# EAGLE design fb-usb (EAGLE 4.16)
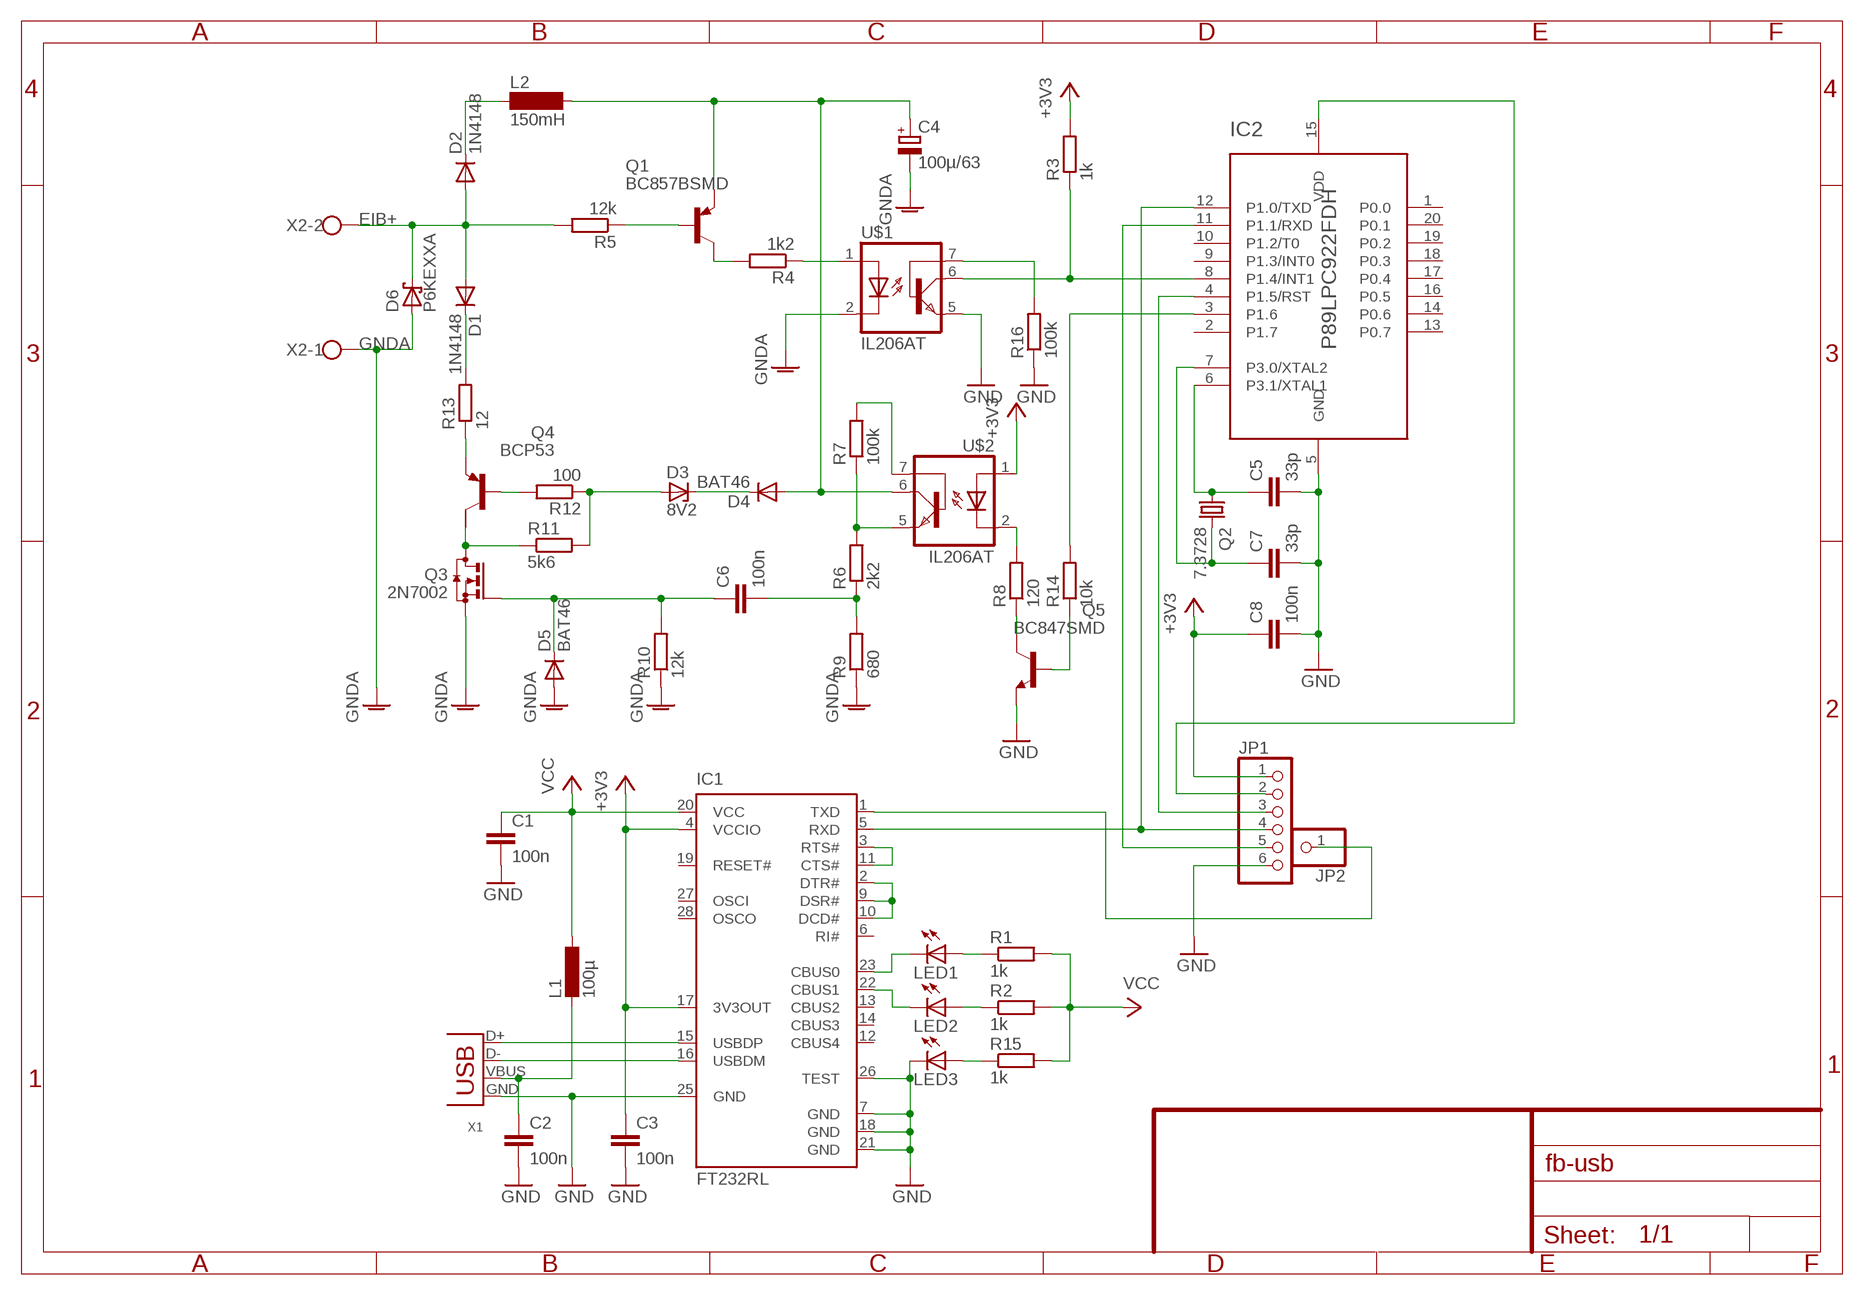
[diagram p0: schematic, sheet 1]

## Parts
C1  100n  C-EUC0805  [C0805]
C2  100n  C-EUC0805  [C0805]
C3  100n  C-EUC0805  [C0805]
C4  100µ/63  CPOL-EUE5-10.5  [E5-10,5]
C5  33p  C-EUC0805  [C0805]
C6  100n  C-EUC0805  [C0805]
C7  33p  C-EUC0805  [C0805]
C8  100n  C-EUC0805  [C0805]
D1  1N4148  DIODE-MINIMELF  [MINIMELF]
D2  1N4148  DIODE-MINIMELF  [MINIMELF]
D3  8V2  ZENER-DIODESOD80C  [SOD80C]
D4  BAT46  DIODE-MINIMELF  [MINIMELF]
D5  BAT46  DIODE-MINIMELF  [MINIMELF]
D6  P6KEXXA  [C1702-15]
IC1  FT232RL  [SSOP28]
IC2  P89LPC922FDH  [TSSOP20]
JP1  PINHD-1X6  [1X06]
JP2  PINHD-1X1  [1X01]
L1  100µ  L-EUL1812  [L1812]
L2  150mH  SD12-1000  [SD12_1000]
LED1  LED3MM  [LED3MM]
LED2  LED3MM  [LED3MM]
LED3  LED3MM  [LED3MM]
Q1  BC857BSMD  [SOT23-BEC]
Q2  7.3728  CRYSTALHC49U-V  [HC49U-V]
Q3  2N7002  BSS123  [SOT23]
Q4  BCP53  FZT753SMD  [SOT223]
Q5  BC847SMD  [SOT23]
R1  1k  R-EU_R1206  [R1206]
R2  1k  R-EU_M1206  [M1206]
R3  1k  R-EU_M0805  [M0805]
R4  1k2  R-EU_M1206  [M1206]
R5  12k  R-EU_M0805  [M0805]
R6  2k2  R-EU_M1206  [M1206]
R7  100k  R-EU_M0805  [M0805]
R8  120  R-EU_0207/10  [0207/10]
R9  680  R-EU_R1206  [R1206]
R10  12k  R-EU_M0805  [M0805]
R11  5k6  R-EU_M0805  [M0805]
R12  100  R-EU_M0805  [M0805]
R13  12  R-EU_0207/10  [0207/10]
R14  10k  R-EU_M0805  [M0805]
R15  1k  R-EU_M1206  [M1206]
R16  100k  R-EU_M0805  [M0805]
U$1  IL206AT  [SOIC08]
U$2  IL206AT  [SOIC08]
X1  USB-B-H  [USB-B-H]
X2  W237-02P  [W237-132]

## Nets
+3V3: C3.1 C8.1 IC1.4(VCCIO) IC1.17(3V3OUT) JP1.1 R3.2 U$2.1(A)
EIB+: D1.A D2.A D6.C R5.2 X2.2
GND: C1.2 C2.2 C3.2 C5.2 C7.2 C8.2 IC1.7(GND) IC1.18(GND) IC1.21(GND) IC1.25(GND) IC1.26(TEST) IC2.5(GND) JP1.6 LED3.K(C) Q5.2(E) R16.1 U$1.5(EMI) X1.GND
GNDA: C4.- D5.A D6.A Q3.2(S) R9.1 R10.1 U$1.2(C) X2.1
N$1: IC1.15(USBDP) X1.D+
N$2: IC1.16(USBDM) X1.D-
N$3: C2.1 L1.2 X1.VBUS
N$4: IC2.11(P1.1/RXD) JP1.5
N$5: IC1.23(CBUS0) LED1.K(C)
N$6: IC1.5(RXD) IC2.12(P1.0/TXD) JP1.4
N$7: IC1.22(CBUS1) LED2.K(C)
N$8: LED1.A R1.1
N$9: LED2.A R2.1
N$10: IC2.8(P1.4/INT1) R3.1 U$1.6(COL)
N$11: IC1.2(DTR#) IC1.9(DSR#) IC1.10(DCD#)
N$12: Q1.C R4.2
N$13: Q1.B R5.1
N$14: D2.C L2.1
N$15: R4.1 U$1.1(A)
N$16: D1.C R13.2
N$17: C4.+ D4.A L2.2 Q1.E U$2.6(COL)
N$18: R8.2 U$2.2(C)
N$19: R16.2 U$1.7(BAS)
N$20: IC2.3(P1.6) R14.2
N$21: R6.2 R7.1 U$2.5(EMI)
N$22: Q3.3(D) Q4.2(C) R11.1
N$23: C6.1 D5.C Q3.1(G) R10.2
N$24: D3.C D4.C
N$25: D3.A R11.2 R12.1
N$26: Q4.3(E) R13.1
N$27: Q4.1(B) R12.2
N$28: Q5.3(C) R8.1
N$29: Q5.1(B) R14.1
N$30: R7.2 U$2.7(BAS)
N$31: IC1.3(RTS#) IC1.11(CTS#)
N$32: IC2.4(P1.5/RST) JP1.3
N$33: IC2.15(VDD) JP1.2
N$34: C5.1 IC2.6(P3.1/XTAL1) Q2.1
N$35: C7.1 IC2.7(P3.0/XTAL2) Q2.2
N$36: IC1.1(TXD) JP2.1
N$37: C6.2 R6.1 R9.2
N$39: LED3.A R15.1
VCC: C1.1 IC1.20(VCC) L1.1 R1.2 R2.2 R15.2
Unconnected: IC1.6(RI#) IC1.12(CBUS4) IC1.13(CBUS2) IC1.14(CBUS3) IC1.19(RESET#) IC1.27(OSCI) IC1.28(OSCO) IC2.1(P0.0) IC2.2(P1.7) IC2.9(P1.3/INT0) IC2.10(P1.2/T0) IC2.13(P0.7) IC2.14(P0.6) IC2.16(P0.5) IC2.17(P0.4) IC2.18(P0.3) IC2.19(P0.2) IC2.20(P0.1) Q4.4(C/)

## Library data of the parts
C1-C3 C5-C8 = rcl:C-EU: CAPACITOR, European symbol
C4 = rcl:CPOL-EU: POLARIZED CAPACITOR, European symbol
D1 D2 D4 D5 = diode:DIODE-: DIODE
D3 = diode:ZENER-DIODE: Z-Diode
D6 = diode:P6KEXXA: DIODE transient-voltage suppressor
IC1 = ftdichip:FT232R: Source: http://www.ftdichip.com/Documents/DataSheets/DS_FT232R_v104.pdf
IC2 = micro-philips:P89LPC922FDH
JP1 = pinhead:PINHD-1X6: PIN HEADER
JP2 = pinhead:PINHD-1X1: PIN HEADER
L1 = rcl:L-EU: INDUCTOR, European symbol
L2 = inductor-neosid:SD12: INDUCTOR nominal inductance
LED1-LED3 = led:LED: LED OSRAM: - CHIPLED LG R971, LG N971, LY N971, LG Q971, LY Q971, LO R971, LY R971 LH N974, LH R974 LS Q976, LO Q976, LY Q976 LO Q996 - Hyper CHIPLED LW Q18S LB Q993, LB Q99A, LB R99A - SideLED LS A670, LO A670, LY A670, LG A670, LP A670 LB A673, LV A673, LT A673, LW A673 LH A674 LY A675 LS A676, LA A676, LO A676, LY A676, LW A676 LS A679, LY A679, LG A679 - Hyper Micro SIDELED® LS Y876, LA Y876, LO Y876, LY Y876 LT Y87S - SmartLED LW L88C, LW L88S LB L89C, LB L89S, LG L890 LS L89K, LO L89K, LY L89K LS L896, LA L896, LO L896, LY L896 - TOPLED LS T670, LO T670, LY T670, LG T670, LP T670 LSG T670, LSP T670, LSY T670, LOP T670, LYG T670 LG T671, LOG T671, LSG T671 LB T673, LV T673, LT T673, LW T673 LH T674 LS T676, LA T676, LO T676, LY T676, LB T676, LH T676, LSB T676, LW T676 LB T67C, LV T67C, LT T67C, LS T67K, LO T67K, LY T67K, LW E67C LS E67B, LA E67B, LO E67B, LY E67B, LB E67C, LV E67C, LT E67C LW T67C LS T679, LY T679, LG T679 LS T770, LO T770, LY T770, LG T770, LP T770 LB T773, LV T773, LT T773, LW T773 LH T774 LS E675, LA E675, LY E675, LS T675 LS T776, LA T776, LO T776, LY T776, LB T776 LHGB T686 LT T68C, LB T68C - Hyper Mini TOPLED® LB M676 - Mini TOPLED Santana® LG M470 LS M47K, LO M47K, LY M47K Source: http://www.osram.convergy.de - LUMILED® LXK2-PW12-R00, LXK2-PW12-S00, LXK2-PW14-U00, LXK2-PW14-V00 LXK2-PM12-R00, LXK2-PM12-S00, LXK2-PM14-U00 LXK2-PE12-Q00, LXK2-PE12-R00, LXK2-PE12-S00, LXK2-PE14-T00, LXK2-PE14-U00 LXK2-PB12-K00, LXK2-PB12-L00, LXK2-PB12-M00, LXK2-PB14-N00, LXK2-PB14-P00, LXK2-PB14-Q00 LXK2-PR12-L00, LXK2-PR12-M00, LXK2-PR14-Q00, LXK2-PR14-R00 LXK2-PD12-Q00, LXK2-PD12-R00, LXK2-PD12-S00 LXK2-PH12-R00, LXK2-PH12-S00 LXK2-PL12-P00, LXK2-PL12-Q00, LXK2-PL12-R00 Source: www.luxeon.com
Q1 = transistor-pnp:BC857*: PNP Transistror
Q2 = crystal:CRYSTAL: CRYSTAL
Q3 = transistor-small-signal:BSS123: N-CHANNEL MOS FET
Q4 = transistor-pnp:FZT753SMD: PNP Transistor
Q5 = transistor-npn:BC847*: NPN Transistor
R1-R16 = rcl:R-EU_: RESISTOR, European symbol
U$1 U$2 = optocoupler:IL206AT
X1 = con-usb-3:USB: USB Connectors
X2 = con-wago-508:W237-02P: WAGO SREW CLAMP

## Board
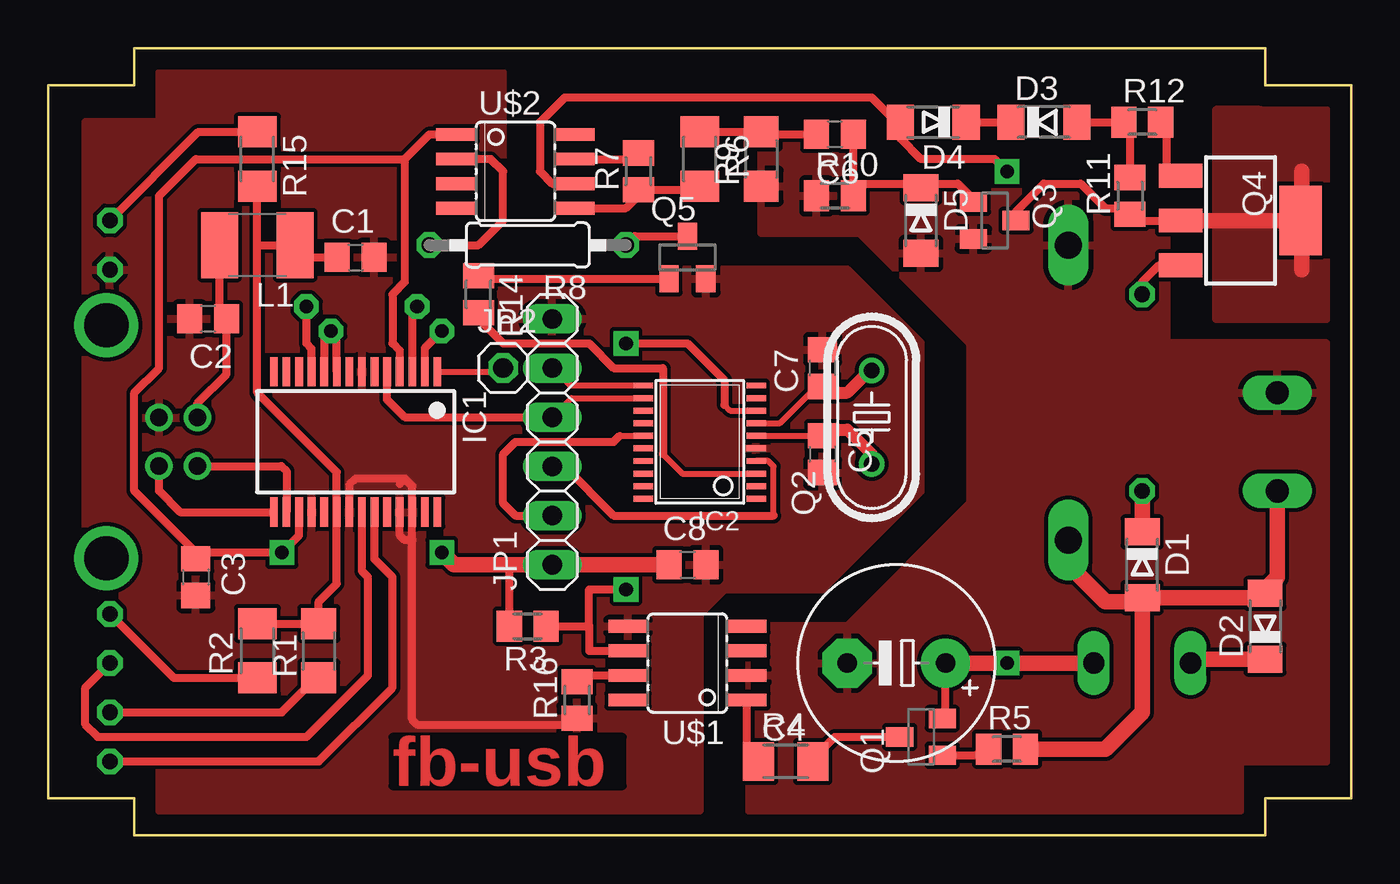
[diagram p1: board, top side]
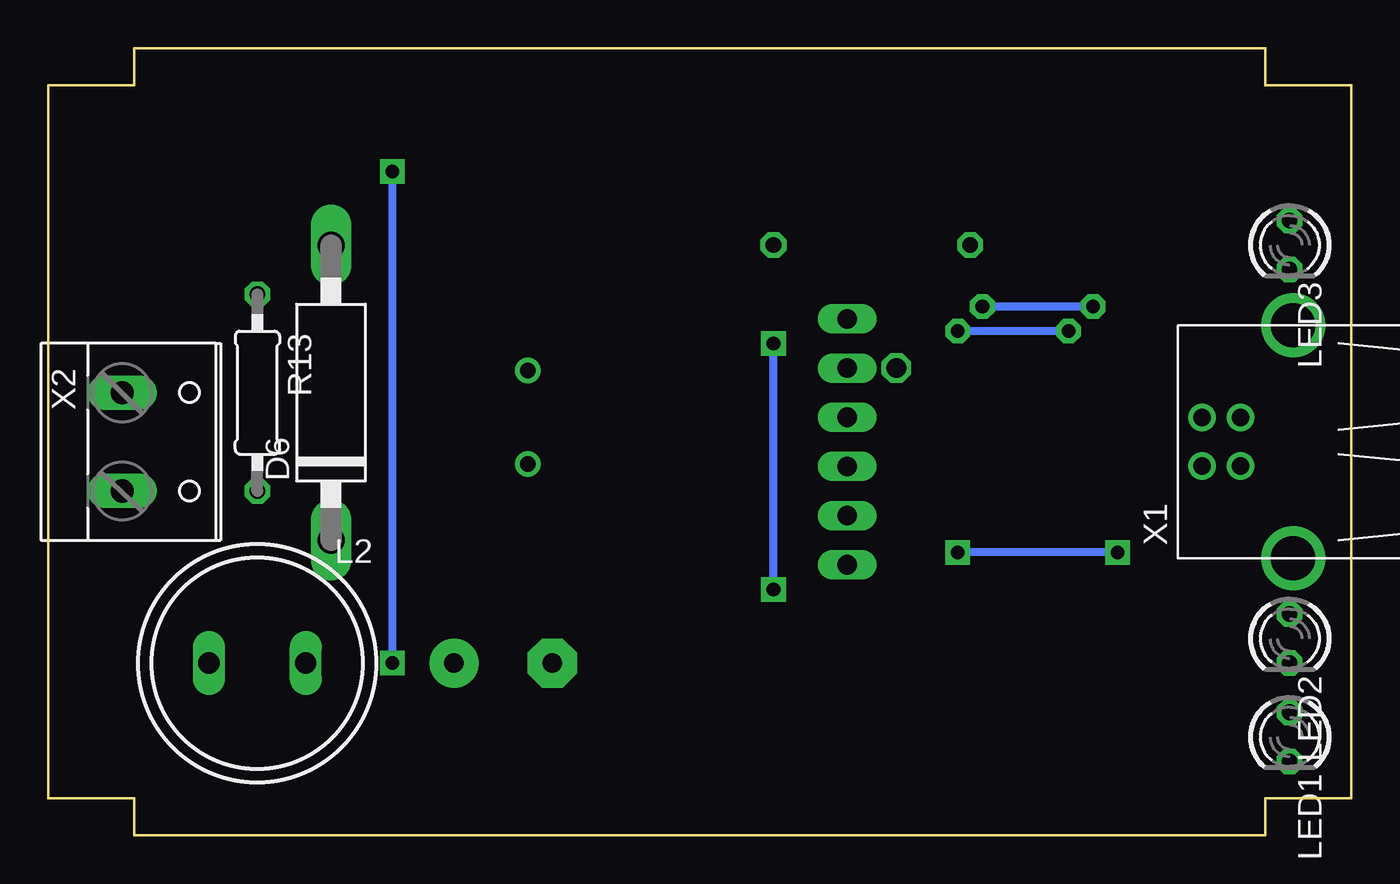
[diagram p2: board, bottom side, seen from below]

Size 67.31 x 40.64 mm. Coordinates in mm from the lower left corner, seen from the top.
Outline: 0,1.91 4.45,1.91 4.45,0 62.86,0 62.86,1.91 67.31,1.91 67.31,38.73 62.86,38.73 62.86,40.64 4.45,40.64 4.45,38.73 0,38.73 0,1.91
Copper layers (1*16): Top 0.035mm / dielectric 1.5mm / Bottom 0.035mm
Design rules "default": minimum track width 10mil, minimum drill 24mil, track to track 8mil, track to pad 8mil, pad to pad 8mil, via to via 8mil, smd to smd 8mil, copper to edge 40mil, drill to drill 8mil, minimum pad ring 10mil, minimum via ring 8mil, stop-mask expansion 4mil, vias tented up to drill 0mil, thermal gap 10mil

### Footprints (pad centres in the part's own frame; a part is rotated, then mirrored left to right if it is on the bottom)
C0805 = smd 1.3 x 1.5: 1 -0.95,0; 2 0.95,0
E5-10,5 = drill 1.016 pad 2.54 round: + -2.54,0 | drill 1.016 pad 2.54 octagon: - 2.54,0
MINIMELF = smd 1.4 x 1.8: A 1.7,0; C -1.7,0
SOD80C = smd 1.4 x 1.8: A 1.7,0; C -1.7,0
C1702-15 = drill 1.397 long: A 7.62,0; C -7.62,0
SSOP28 = smd 0.4 x 1.5: 1 -4.225,-3.625; 2 -3.575,-3.625; 3 -2.925,-3.625; 4 -2.275,-3.625; 5 -1.625,-3.625; 6 -0.975,-3.625; 7 -0.325,-3.625; 8 0.325,-3.625; 9 0.975,-3.625; 10 1.625,-3.625; 11 2.275,-3.625; 12 2.925,-3.625; 13 3.575,-3.625; 14 4.225,-3.625; 15 4.225,3.625; 16 3.575,3.625; 17 2.925,3.625; 18 2.275,3.625; 19 1.625,3.625; 20 0.975,3.625; 21 0.325,3.625; 22 -0.325,3.625; 23 -0.975,3.625; 24 -1.625,3.625; 25 -2.275,3.625; 26 -2.925,3.625; 27 -3.575,3.625; 28 -4.225,3.625
TSSOP20 = smd 0.305 x 0.991: 1 -2.94,-2.918; 2 -2.29,-2.918; 3 -1.64,-2.918; 4 -0.99,-2.918; 5 -0.34,-2.918; 6 0.31,-2.918; 7 0.96,-2.918; 8 1.61,-2.918; 9 2.26,-2.918; 10 2.91,-2.918; 11 2.91,2.918; 12 2.26,2.918; 13 1.61,2.918; 14 0.96,2.918; 15 0.31,2.918; 16 -0.34,2.918; 17 -0.99,2.918; 18 -1.64,2.918; 19 -2.29,2.918; 20 -2.94,2.918
1X06 = drill 1.016 long: 1 -6.35,0; 2 -3.81,0; 3 -1.27,0; 4 1.27,0; 5 3.81,0; 6 6.35,0
1X01 = drill 1.016 octagon: 1 0,0
L1812 = smd 1.9 x 3.4: 1 -1.95,0; 2 1.95,0
SD12_1000 = drill 1.1 long: 1 -2.5,0; 2 2.5,0
LED3MM = drill 0.813 octagon: A -1.27,0; K 1.27,0
SOT23-BEC = smd 1 x 1.4: B -0.95,-1.1; C 0,1.1; E 0.95,-1.1
HC49U-V = drill 0.813 round: 1 -2.413,0; 2 2.413,0
SOT23 = smd 1 x 1.4: 1 -0.95,-1.1; 2 0.95,-1.1; 3 0,1.1
SOT223 = smd 1.219 x 2.235: 1 -2.311,-3.099; 2 0,-3.099; 3 2.311,-3.099 | smd 3.6 x 2.2: 4 0,3.099
R1206 = smd 1.6 x 1.8: 1 -1.4,0; 2 1.4,0
M1206 = smd 1.6 x 2: 1 -1.4,0; 2 1.4,0
M0805 = smd 1.3 x 1.6: 1 -0.95,0; 2 0.95,0
0207/10 = drill 0.813 octagon: 1 -5.08,0; 2 5.08,0
SOIC08 = smd 0.66 x 2.032: 1 -1.905,-3.073; 2 -0.635,-3.073; 3 0.635,-3.073; 4 1.905,-3.073; 5 1.905,3.073; 6 0.635,3.073; 7 -0.635,3.073; 8 -1.905,3.073
USB-B-H = drill 0.914 round: D+ 0,1.25; D- 1.981,1.25; GND 0,-1.25; VBUS 1.981,-1.25 | drill 2.286 round: P$1 -2.718,-6.02; P$2 -2.718,6.02
W237-132 = drill 1.194 long: 1 -2.54,-0.635; 2 2.54,-0.635

### Placement (x,y rotation side)
C1  15.88,29.84 0 top
C2  8.26,26.67 180 top
C3  7.62,13.34 270 top
C4  43.81,8.89 180 top
C5  40,19.68 270 top
C6  40.64,36.2 180 top
C7  40,24.13 90 top
C8  33.02,13.97 0 top
D1  56.52,13.97 270 top
D2  62.86,10.79 90 top
D3  51.43,36.83 0 top
D4  45.72,36.83 180 top
D5  45.09,31.75 270 top
D6  52.7,22.86 90 bottom
IC1  15.88,20.32 180 top
IC2  33.66,20.32 90 top
JP1  26.04,20.32 90 top
JP2  23.5,24.13 0 top
L1  10.79,30.48 180 top
L2  56.52,8.89 0 bottom
LED1  3.17,5.08 270 bottom
LED2  3.17,10.16 270 bottom
LED3  3.17,30.48 270 bottom
Q1  45.09,5.08 90 top
Q2  42.54,21.59 90 top
Q3  48.89,31.75 270 top
Q4  61.59,31.75 270 top
Q5  33.02,29.84 0 top
R1  13.97,9.53 90 top
R2  10.79,9.53 90 top
R3  24.77,10.79 180 top
R4  38.1,3.81 0 top
R5  49.53,4.45 0 top
R6  33.66,34.92 270 top
R7  30.48,34.29 90 top
R8  24.77,30.48 180 top
R9  36.83,34.92 90 top
R10  40.64,33.02 0 top
R11  55.88,33.02 90 top
R12  56.52,36.83 0 top
R13  56.52,22.86 270 bottom
R14  22.23,27.94 270 top
R15  10.79,34.92 270 top
R16  27.31,6.99 90 top
U$1  33.02,8.89 90 top
U$2  24.13,34.29 270 top
X1  5.71,20.32 180 bottom
X2  62.86,20.32 270 bottom

### Tracks (layer width: path | path; a pad name or v marks a point on that pad's centre or on a via)
+3V3  (via drill 0.7 pad 1.27)
  Top 0.406: IC1.17 12.95,15.49 v12.06,14.61 7.62,14.61 | 18.42,34.92 18.42,28.57 17.78,27.94 17.78,25.4 18.15,25.03 IC1.4 | 18.42,34.92 7.62,34.92 5.71,33.02 5.71,24.13 4.45,22.86 4.45,17.78 7.62,14.61 | C3.1 7.62,14.61 | U$2.1 19.69,36.2 18.42,34.92 | R3.2 23.82,13.65 23.81,13.65 23.5,13.97
  Top 0.813: C8.1 JP1.1 23.5,13.97 20.96,13.97 v20.32,14.61
  Bottom 0.406: v12.06,14.61 v20.32,14.61
EIB+
  Top 0.813: X2.2 63.5,13.34 62.86,12.7 | 62.86,12.7 D2.A | 62.86,12.7 62.43,12.27 D1.A 56.52,12.06 | D6.C 52.7,13.97 54.61,12.06 56.52,12.06 | R5.2 54.61,4.45 56.52,6.35 56.52,12.06
GND
  Top 0.406: 18.42,18.41 15.88,18.41 15.55,18.09 IC1.21 | 18.42,18.41 18.15,18.15 | 18.8,15.24 18.8,5.96 19.05,5.71 27.31,5.71 R16.1 | 18.8,15.24 IC1.26 18.8,18.03 18.42,18.41 | 18.8,15.24 18.42,15.24 18.15,15.51 IC1.25
  pour Top: 1.91,36.83 1.91,3.81 5.71,3.81 5.71,1.27 33.66,1.27 33.66,11.43 34.92,12.7 40,12.7 45.09,17.78 45.09,25.4 41.27,29.21 23.5,29.21 23.5,39.37 5.71,39.37 5.71,36.83
GNDA
  pour Top: 36.2,10.79 36.2,1.27 61.59,1.27 61.59,3.81 66.04,3.81 66.04,25.4 57.78,25.4 57.78,39.37 36.83,39.37 36.83,31.11 41.91,31.11 47.62,25.4 47.62,17.14 41.27,10.79
N$1
  Top 0.406: IC1.15 6.8,16.7 5.71,17.78 X1.D+
N$2
  Top 0.406: IC1.16 12.3,18.82 12.04,19.07 X1.D-
N$3
  Top 0.406: X1.VBUS 7.7,22.3 9.21,23.81 C2.1 9.53,26.67 8.85,27.35 L1.2
N$4
  Top 0.305: IC2.11 26.94,23.23 JP1.5
N$5
  Top 0.406: LED1.K 13.97,3.81 17.78,7.62 17.78,13.34 16.85,14.27 IC1.23
N$6
  Top 0.305: IC2.12 27.03,22.58 JP1.4
  Top 0.406: IC1.5 17.5,22.5 18.42,21.59 JP1.4
N$7
  Top 0.406: IC1.22 16.2,13.64 16.51,13.34 16.51,8.26 13.33,5.08 2.54,5.08 1.91,5.71 1.91,7.62 LED2.K
N$8
  Top 0.406: LED1.A 12.06,6.35 13.97,8.26 R1.1
N$9
  Top 0.406: R2.1 6.48,8.12 LED2.A
N$10  (via drill 0.7 pad 1.27)
  Top 0.305: IC2.8 35.22,21.93 34.92,22.23
  Top 0.406: U$1.6 27.94,9.53 27.94,10.79 | 34.92,22.23 34.92,23.5 33.02,25.4 v29.85,25.4 | v29.85,12.7 27.94,12.7 27.94,10.79 | R3.1 27.94,10.79
  Bottom 0.406: v29.85,12.7 v29.85,25.4
N$11  (via drill 0.7 pad 1.27)
  Top 0.406: IC1.2 19.45,25.16 v20.32,26.04 | IC1.9 14.9,25.74 v14.61,26.04 14.25,25.68 IC1.10
  Bottom 0.406: v14.61,26.04 v20.32,26.04
N$12
  Top 0.406: Q1.C 40.64,5.08 39.5,3.94 R4.2
N$13
  Top 0.406: R5.1 48.26,4.45 47.95,4.13 Q1.B
N$14
  Top 0.813: L2.1 59.05,8.89 59.05,9.1 D2.C
N$15
  Top 0.406: R4.1 36.2,3.81 36.09,3.91 U$1.1
N$16
  Top 0.813: D1.C R13.2
N$17  (via drill 0.7 pad 1.27)
  Top 0.406: U$2.6 26.04,33.66 25.4,34.29 25.4,36.83 26.67,38.1 42.54,38.1 43.81,36.83 D4.A 44.02,35.99 45.09,34.92 48.89,34.92 v49.53,34.29 | Q1.E 46.18,6.18 46.35,6.35 C4.+
  Top 0.813: C4.+ v49.53,8.89 L2.2
  Bottom 0.406: v49.53,8.89 v49.53,34.29
N$18
  Top 0.406: U$2.2 22.86,34.92 23.5,34.29 23.5,31.75 22.23,30.48 R8.2
N$19
  Top 0.406: U$1.7 27.31,8.26 R16.2
N$20
  Top 0.305: IC2.3 32.75,18.68 31.75,19.68
  Top 0.406: R14.2 22.23,26.67 23.5,25.4 27.94,25.4 29.21,24.13 31.75,24.13 31.75,19.68
N$21
  Top 0.406: U$2.5 29.85,32.38 30.48,33.02 R7.1 33.34,33.34 33.66,33.66 R6.2
N$22
  Top 0.406: Q3.3 49.99,32.22 51.43,33.66 53.34,33.66 54.61,32.38 55.88,32.38 R11.1 55.88,31.75 58.42,31.75 Q4.2
  Top 0.813: 58.42,31.75 64.77,31.75 | 64.77,31.75 64.77,34.29 | 64.77,31.75 64.77,29.21
  pour Top: 60.32,37.47 60.32,26.67 66.04,26.67 66.04,37.47
N$23
  Top 0.406: Q3.1 47.95,32.7 46.99,33.66 45.09,33.66 | 45.09,33.66 D5.C | C6.1 41.91,36.2 41.59,35.88 41.59,33.66 | R10.2 41.59,33.66 | 41.59,33.66 45.09,33.66
N$24
  Top 0.406: D4.C D3.C
N$25
  Top 0.406: R11.2 55.88,36.83 R12.1 D3.A
N$26
  Top 0.406: Q4.3 57.38,29.44 56.52,28.57 R13.1
N$27
  Top 0.406: Q4.1 58.01,34.06 57.78,34.29 57.78,36.83 R12.2
N$28
  Top 0.406: Q5.3 30.31,30.95 R8.1
N$29
  Top 0.406: R14.1 22.23,28.57 22.4,28.75 Q5.1
N$30
  Top 0.406: R7.2 30.48,34.92 U$2.7
N$31  (via drill 0.7 pad 1.27)
  Top 0.406: IC1.11 13.6,25.14 13.33,25.4 v13.33,27.3 | IC1.3 18.8,27.05 v19.05,27.3
  Bottom 0.406: v13.33,27.3 v19.05,27.3
N$32
  Top 0.305: 37.46,16.51 37.46,19.05 37.18,19.33 IC2.4
  Top 0.406: JP1.3 26.67,19.05 29.21,16.51 37.46,16.51
N$33
  Top 0.305: 29.52,20.63 IC2.15
  Top 0.406: 29.52,20.63 29.21,20.32 24.13,20.32 23.5,19.68 23.5,17.14 24.13,16.51 JP1.2
N$34
  Top 0.305: C5.1 40,20.32 39.7,20.63 IC2.6
  Top 0.61: Q2.1 42.54,19.68 41.27,20.95 40,20.95 C5.1
N$35
  Top 0.305: IC2.7 37.79,21.28 39.37,22.86 40,22.86
  Top 0.61: Q2.2 42.42,24 41.27,22.86 40,22.86 C7.1
N$36
  Top 0.305: IC1.1 23.31,23.95 JP2.1
N$37
  Top 0.406: 36.83,36.2 C6.2 | 36.83,36.2 R9.2 | R6.1 36.7,36.33 36.83,36.2
N$39
  Top 0.406: R15.1 7.75,36.33 LED3.A
VCC
  Top 0.406: 10.79,30.48 12.7,30.48 | 10.79,30.48 10.79,22.86 14.9,18.75 IC1.20 14.9,12.99 13.97,12.06 R1.2 | R1.2 13.97,10.79 | R2.2 10.79,10.79 10.92,10.93 R1.2 | C1.1 13.33,29.84 12.7,30.48 | 12.7,30.48 L1.1 | 10.79,33.66 R15.2 10.79,30.48

### Text on the board
Top: fb-usb